# Altium schematic sheet 12VSupply_1.5A.SchDoc (part 1 of 2)
size A; SheetNumber: 3; SheetTotal: 3
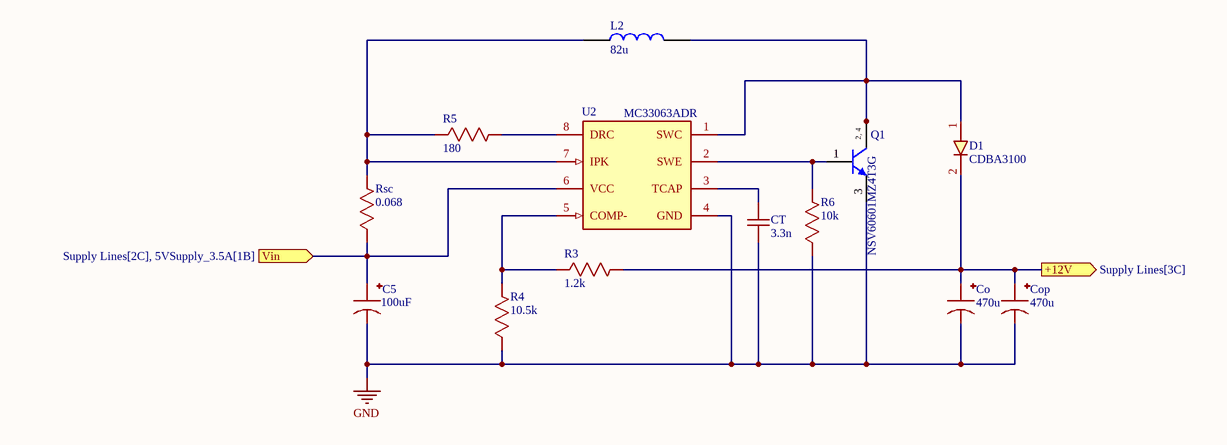
[diagram p0: 12VSupply_1.5A.SchDoc]

## Parts
C5  100uF  [CAPPRD350W60D800H1150]
Co  470u  [CAP_PKPZ_10X12P5_LOW_RUB]
Cop  470u  [CAP_PKPZ_10X12P5_LOW_RUB]
CT  3.3n  [(KEMET 0805) FP-C0805C-DN-IPC_A - duplicate]
D1  CDBA3100  [CDBA3100]
L2  82u  [PA4344823ANLT]
Q1  NSV60601MZ4T3G  [ONSC-SOT-223-4-318E-04_V]
R3  1.2k  [FP-CRGCQ0805-IPC_A]
R4  10.5k
R5  180  [FP-RMCF0805-IPC_A]
R6  10k  [FP-CRGCQ0805-IPC_A]
Rsc  0.068  [(1206) RESC3216X70X50NL05T20]
U2  MC33063ADR  [D0008A_L]

## Ports
+12V (out, see Supply Lines[3C]), Vin (in, see Supply Lines[2C], 5VSupply_3.5A[1B])

## Nets
GND: C5.2 Co.2 Cop.2 CT.1 Q1.3(E) R4.1 R6.1 U2.4(GND)
+12V: Co.1 Cop.1 D1.2 R3.2 ; port +12V
Vin: C5.1 Rsc.1 U2.6(VCC) ; port Vin
NetCT_2: CT.2 U2.3(TCAP)
NetD1_1: D1.1 L2.2 Q1.2(C) Q1.4(C) U2.1(SWC)
NetL2_1: L2.1 R5.1 Rsc.2 U2.7(IPK)
NetQ1_1: Q1.1(B) R6.2 U2.2(SWE)
NetR3_1: R3.1 R4.2 U2.5(COMP-)
NetR5_2: R5.2 U2.8(DRC)
## Library data of the parts
C5 = EEU-FR1V101B: FR ALUMINUM ELECTROLYTIC CAPACITOR Radial Can aluminum electrolytic capacitor 0.315Dia 8.00mm ±20% 100muF 35V; Manufacturer: Panasonic; Value: 100µF; Lead Diameter: 600µm; Life (Hours): 6000hours; Ripple Current: 950mA; Supplier: DigiKey; Supplier Part Number: P124226CT-ND; Manufacturer Part Number: EEU-FR1V101B; RoHS: Compliant; Category: Aluminum Electrolytic Capacitors; Stock: 15444; Pricing: 1=0.61, 10=0.383, 50=0.2852, 100=0.2542, 500=0.20076 (USD); Case/Package: Radial; Contact Plating: Tin; Diameter: 8mm; Lead Pitch: 5mm; Max Operating Temperature: 105°C; Min Operating Temperature: -40°C; Mounting Technology: Through Hole; Schedule B: 8532220020, 8532220020|8532220020, 8532220020|8532220020|8532220020, 8532220020|8532220020|8532220020|8532220020; Termination: Radial; Tolerance: 20%; ComponentLink1URL: https://datasheet.octopart.com:443/EEU-FR1V101B-Panasonic-datasheet-62330550.pdf?src-supplier=Electro+Sonic; ComponentLink1Description: https://datasheet.octopart.com:443/EEU-FR1V101B-Panasonic-datasheet-62330550.pdf?src-supplier=Electro+Sonic
Co Cop = 35PX470MEFC10X12.5: Aluminum Electrolytic Capacitor, Polarized, Aluminum (wet), 35V, 20% +Tol, 20% -Tol, 470uF; Manufacturer: Rubycon; Value: 470µF; Life (Hours): 2000hours; Polarity: Polar; Ripple Current: 525mA; Supplier: Mouser; Supplier Part Number: 232-35PX470MEFC10X12; Manufacturer Part Number: 35PX470MEFC10X12.5; RoHS: Compliant; Category: Aluminum Electrolytic Capacitors; Stock: 10207; Pricing: 1=0.46, 10=0.25, 50=0.25, 100=0.232, 1000=0.183, 10000=0.183 (USD); Case/Package: Radial; Diameter: 10mm; Height: 12.5mm; Height - Seated (Max): 13.9954mm; Lead Pitch: 5mm; Length: 12.5mm; Lifecycle Status: Production; Max Operating Temperature: 105°C; Min Operating Temperature: -55°C; Mounting Technology: Through Hole; Pins: 2; Number of Terminals: 2; Packaging: Bulk; REACH SVHC: Yes; Ripple Current (AC): 525mA; Schedule B: 8532220020, 8532220020|8532220020|8532220020|8532220020|8532220020; Terminal Pitch: 5mm; Tolerance: 20%; Voltage Rating: 35V; Voltage Rating (DC): 35V; ComponentLink1URL: https://datasheet.octopart.com:443/35PX470MEFC10X12.5-Rubycon-datasheet-159569471.pdf?src-supplier=IHS; ComponentLink1Description: https://datasheet.octopart.com:443/35PX470MEFC10X12.5-Rubycon-datasheet-159569471.pdf?src-supplier=IHS; ComponentLink2URL: https://datasheet.octopart.com:443/35PX470MEFC10X12.5-Rubycon-datasheet-86451557.pdf?src-supplier=Master+Electronics; ComponentLink2Description: https://datasheet.octopart.com:443/35PX470MEFC10X12.5-Rubycon-datasheet-86451557.pdf?src-supplier=Master+Electronics; ComponentLink3URL: https://datasheet.octopart.com:443/35PX470MEFC10X12.5-Rubycon-datasheet-41169268.pdf?src-supplier=Newark; ComponentLink3Description: https://datasheet.octopart.com:443/35PX470MEFC10X12.5-Rubycon-datasheet-41169268.pdf?src-supplier=Newark; ComponentLink4URL: https://datasheet.octopart.com:443/35PX470MEFC10X12.5-Rubycon-datasheet-12529491.pdf?src-supplier=element14+APAC; ComponentLink4Description: https://datasheet.octopart.com:443/35PX470MEFC10X12.5-Rubycon-datasheet-12529491.pdf?src-supplier=element14+APAC
CT = C0805C332K5RACTU: SMD Multilayer Ceramic Capacitor, 3300 pF, 50 V, 0805 [2012 Metric], X7R; Manufacturer: KEMET; Value: 3.3nF; Dissipation Factor: 2.5%; Temperature Coefficient: 30ppm/°C; Tolerance: 10%; Voltage: 50V; Supplier: Mouser; Supplier Part Number: 80-C0805C332K5R; Manufacturer Part Number: C0805C332K5RACTU; RoHS: Compliant; Category: Ceramic Capacitors; Stock: 23962; Pricing: 1=0.1, 10=0.03, 50=0.03, 100=0.026, 500=0.019, 1000=0.017, 4000=0.009, 8000=0.008, 10000=0.008 (USD); Case/Package: 0805; Case Code (Imperial): 0805; China RoHS: Compliant; Contact Plating: Tin; Country of Origin: Mexico; Depth: 1.25mm; Dielectric: X7R; Dielectric Material: Ceramic; Export Control Classification Number (ECCN) Code: EAR99; Height: 780µm; Harmonized Tariff Schedule (HTS) Code: 8532.24.00.20; Introduction Date: 2008-01-10; Lead Free: Lead Free; Lead Pitch: 750µm; Length: 2mm; Lifecycle Status: Production; Material: Ceramic; Max Operating Temperature: 125°C; Min Operating Temperature: -55°C; Mounting Technology: Surface Mount; Pins: 2; Number of Terminals: 2; Packaging: Cut Tape; Radiation Hardening: No; REACH SVHC: Yes; Schedule B: 8532240020, 8532240020|8532240020, 8532240020|8532240020|8532240020, 8532240020|8532240020|8532240020|8532240020; Termination: SMD/SMT; Thickness: 889µm; Voltage Rating: 50V; Voltage Rating (AC): 50V; Voltage Rating (DC): 50V; Width: 1.25mm; ComponentLink1URL: https://datasheet.octopart.com:443/C0805C332K5RACTU-KEMET-datasheet-178445679.pdf?src-supplier=IHS; ComponentLink1Description: https://datasheet.octopart.com:443/C0805C332K5RACTU-KEMET-datasheet-178445679.pdf?src-supplier=IHS; ComponentLink2URL: https://datasheet.octopart.com:443/C0805C332K5RAC7800-KEMET-datasheet-182042190.pdf?src-supplier=IHS; ComponentLink2Description: https://datasheet.octopart.com:443/C0805C332K5RAC7800-KEMET-datasheet-182042190.pdf?src-supplier=IHS; ComponentLink3URL: https://datasheet.octopart.com:443/C0805C332K5RACTU-KEMET-datasheet-137357759.pdf?src-supplier=Farnell; ComponentLink3Description: https://datasheet.octopart.com:443/C0805C332K5RACTU-KEMET-datasheet-137357759.pdf?src-supplier=Farnell; ComponentLink4URL: https://datasheet.octopart.com:443/C0805C332K5RACTU-Kemet-datasheet-12608295.pdf?src-supplier=Farnell; ComponentLink4Description: https://datasheet.octopart.com:443/C0805C332K5RACTU-Kemet-datasheet-12608295.pdf?src-supplier=Farnell; ComponentLink5URL: https://datasheet.octopart.com:443/C0805C332K5RACTU-Kemet-datasheet-11992184.pdf?src-supplier=Farnell; ComponentLink5Description: https://datasheet.octopart.com:443/C0805C332K5RACTU-Kemet-datasheet-11992184.pdf?src-supplier=Farnell; ComponentLink6URL: https://datasheet.octopart.com:443/C0805C332K5RACTU-Kemet-datasheet-10942409.pdf?src-supplier=Farnell; ComponentLink6Description: https://datasheet.octopart.com:443/C0805C332K5RACTU-Kemet-datasheet-10942409.pdf?src-supplier=Farnell; ComponentLink7URL: https://datasheet.octopart.com:443/C0805C332K5RACTU-Kemet-datasheet-10404442.pdf?src-supplier=Farnell; ComponentLink7Description: https://datasheet.octopart.com:443/C0805C332K5RACTU-Kemet-datasheet-10404442.pdf?src-supplier=Farnell; ComponentLink8URL: https://datasheet.octopart.com:443/C0805C332K5RACTU-KEMET-datasheet-101576272.pdf?src-supplier=Farnell; ComponentLink8Description: https://datasheet.octopart.com:443/C0805C332K5RACTU-KEMET-datasheet-101576272.pdf?src-supplier=Farnell; ComponentLink9URL: https://datasheet.octopart.com:443/C0805C332K5RACTU-KEMET-datasheet-176142338.pdf?src-supplier=Farnell; ComponentLink9Description: https://datasheet.octopart.com:443/C0805C332K5RACTU-KEMET-datasheet-176142338.pdf?src-supplier=Farnell; ComponentLink10URL: https://datasheet.octopart.com:443/C0805C332K5RACTU-Kemet-datasheet-500041.pdf?src-supplier=Farnell; ComponentLink10Description: https://datasheet.octopart.com:443/C0805C332K5RACTU-Kemet-datasheet-500041.pdf?src-supplier=Farnell; ComponentLink11URL: https://datasheet.octopart.com:443/C0805C332K5RACTU-Kemet-datasheet-10026209.pdf?src-supplier=Farnell; ComponentLink11Description: https://datasheet.octopart.com:443/C0805C332K5RACTU-Kemet-datasheet-10026209.pdf?src-supplier=Farnell; ComponentLink12URL: https://datasheet.octopart.com:443/C0805C332K5RACTU-KEMET-datasheet-68331921.pdf?src-supplier=Upverter; ComponentLink12Description: https://datasheet.octopart.com:443/C0805C332K5RACTU-KEMET-datasheet-68331921.pdf?src-supplier=Upverter; ComponentLink13URL: https://datasheet.octopart.com:443/C0805C332K5RACTU-KEMET-datasheet-159486434.pdf?src-supplier=Newark; ComponentLink13Description: https://datasheet.octopart.com:443/C0805C332K5RACTU-KEMET-datasheet-159486434.pdf?src-supplier=Newark; ComponentLink14URL: https://datasheet.octopart.com:443/C0805C332K5RACTU-Kemet-datasheet-5313890.pdf?src-supplier=Newark; ComponentLink14Description: https://datasheet.octopart.com:443/C0805C332K5RACTU-Kemet-datasheet-5313890.pdf?src-supplier=Newark; ComponentLink15URL: https://datasheet.octopart.com:443/C0805C332K5RACTU-KEMET-datasheet-176142341.pdf?src-supplier=Newark; ComponentLink15Description: https://datasheet.octopart.com:443/C0805C332K5RACTU-KEMET-datasheet-176142341.pdf?src-supplier=Newark; ComponentLink16URL: https://datasheet.octopart.com:443/C0805C332K5RACTU-KEMET-datasheet-130256537.pdf?src-supplier=Newark; ComponentLink16Description: https://datasheet.octopart.com:443/C0805C332K5RACTU-KEMET-datasheet-130256537.pdf?src-supplier=Newark; ComponentLink17URL: https://datasheet.octopart.com:443/C0805C332K5RACTU-Kemet-datasheet-8764837.pdf?src-supplier=Newark; ComponentLink17Description: https://datasheet.octopart.com:443/C0805C332K5RACTU-Kemet-datasheet-8764837.pdf?src-supplier=Newark; ComponentLink18URL: https://datasheet.octopart.com:443/C0805C332K5RACTU-Kemet-datasheet-8480123.pdf?src-supplier=Newark; ComponentLink18Description: https://datasheet.octopart.com:443/C0805C332K5RACTU-Kemet-datasheet-8480123.pdf?src-supplier=Newark; ComponentLink19URL: https://datasheet.octopart.com:443/C0805C332K5RACTU-Kemet-datasheet-5390537.pdf?src-supplier=Newark; ComponentLink19Description: https://datasheet.octopart.com:443/C0805C332K5RACTU-Kemet-datasheet-5390537.pdf?src-supplier=Newark; ComponentLink20URL: https://datasheet.octopart.com:443/C0805C332K5RACTU-Kemet-datasheet-5393970.pdf?src-supplier=Newark; ComponentLink20Description: https://datasheet.octopart.com:443/C0805C332K5RACTU-Kemet-datasheet-5393970.pdf?src-supplier=Newark; ComponentLink21URL: https://datasheet.octopart.com:443/C0805C332K5RACTU-Kemet-datasheet-8502025.pdf?src-supplier=Newark; ComponentLink21Description: https://datasheet.octopart.com:443/C0805C332K5RACTU-Kemet-datasheet-8502025.pdf?src-supplier=Newark; ComponentLink22URL: https://datasheet.octopart.com:443/C0805C332K5RACTU-Kemet-datasheet-7541751.pdf?src-supplier=Newark; ComponentLink22Description: https://datasheet.octopart.com:443/C0805C332K5RACTU-Kemet-datasheet-7541751.pdf?src-supplier=Newark; ComponentLink23URL: https://datasheet.octopart.com:443/C0805C332K5RACTU-Kemet-datasheet-161801.pdf?src-supplier=Newark; ComponentLink23Description: https://datasheet.octopart.com:443/C0805C332K5RACTU-Kemet-datasheet-161801.pdf?src-supplier=Newark; ComponentLink24URL: https://datasheet.octopart.com:443/C0805C332K5RACTU-KEMET-datasheet-37550250.pdf?src-supplier=Electro+Sonic; ComponentLink24Description: https://datasheet.octopart.com:443/C0805C332K5RACTU-KEMET-datasheet-37550250.pdf?src-supplier=Electro+Sonic; ComponentLink25URL: https://datasheet.octopart.com:443/C0805C332K5RACTU-KEMET-datasheet-164512540.pdf?src-supplier=TME; ComponentLink25Description: https://datasheet.octopart.com:443/C0805C332K5RACTU-KEMET-datasheet-164512540.pdf?src-supplier=TME; ComponentLink26URL: https://datasheet.octopart.com:443/C0805C332K5RACTU-Kemet-datasheet-68096424.pdf?src-supplier=TME; ComponentLink26Description: https://datasheet.octopart.com:443/C0805C332K5RACTU-Kemet-datasheet-68096424.pdf?src-supplier=TME; ComponentLink27URL: https://datasheet.octopart.com:443/C0805C332K5RACTU-KEMET-datasheet-68331906.pdf?src-supplier=TME; ComponentLink27Description: https://datasheet.octopart.com:443/C0805C332K5RACTU-KEMET-datasheet-68331906.pdf?src-supplier=TME; ComponentLink28URL: https://datasheet.octopart.com:443/C0805C332K5RACTU-KEMET-datasheet-110724412.pdf?src-supplier=RS+(Formerly+Allied+Electronics); ComponentLink28Description: https://datasheet.octopart.com:443/C0805C332K5RACTU-KEMET-datasheet-110724412.pdf?src-supplier=RS+(Formerly+Allied+Electronics); ComponentLink29URL: https://datasheet.octopart.com:443/C0805C332K5RACTU-Kemet-datasheet-464.pdf?src-supplier=RS+(Formerly+Allied+Electronics); ComponentLink29Description: https://datasheet.octopart.com:443/C0805C332K5RACTU-Kemet-datasheet-464.pdf?src-supplier=RS+(Formerly+Allied+Electronics); ComponentLink30URL: https://datasheet.octopart.com/C0805C332K5RACTU-KEMET-datasheet-84169754.pdf; ComponentLink30Description: https://datasheet.octopart.com/C0805C332K5RACTU-KEMET-datasheet-84169754.pdf; ComponentLink31URL: https://datasheet.octopart.com:443/C0805C332K5RACTU-Kemet-datasheet-22084244.pdf?src-supplier=element14+APAC; ComponentLink31Description: https://datasheet.octopart.com:443/C0805C332K5RACTU-Kemet-datasheet-22084244.pdf?src-supplier=element14+APAC; ComponentLink32URL: https://datasheet.octopart.com:443/C0805C332K5RAC7800-KEMET-datasheet-164857143.pdf?src-supplier=Burklin+Elektronik; ComponentLink32Description: https://datasheet.octopart.com:443/C0805C332K5RAC7800-KEMET-datasheet-164857143.pdf?src-supplier=Burklin+Elektronik; ComponentLink33URL: https://datasheet.octopart.com:443/C0805C332K5RAC-TU-Kemet-datasheet-8196850.pdf?src-supplier=Jameco; ComponentLink33Description: https://datasheet.octopart.com:443/C0805C332K5RAC-TU-Kemet-datasheet-8196850.pdf?src-supplier=Jameco
D1 = CDBA3100-G: Rectifier Diode, Schottky, 1 Phase, 1 Element, 3A, 100V V(RRM), Silicon, DO-214AC; Manufacturer: Comchip; Forward Voltage: 850mV; Max Forward Surge Current (Ifsm): 80A; Max Reverse Leakage Current: 500µA; Number of Elements: 1; Supplier: DigiKey; Supplier Part Number: 641-1099-1-ND; Manufacturer Part Number: CDBA3100-G; RoHS: Compliant; Category: Rectifier Diodes; Stock: 37850; Pricing: 1=0.32, 10=0.284, 100=0.2475, 500=0.24302, 2000=0.22072 (USD); Average Rectified Current: 3A; Contact Plating: Tin; Lifecycle Status: Obsolete; Max Operating Temperature: 150°C; Max Output current: 3A; Max Reverse Voltage (DC): 100V; Max Surge Current: 80A; Min Operating Temperature: -55°C; Mounting Technology: Surface Mount; Number of Terminals: 2; Peak Reverse Current: 500µA; REACH SVHC: No; Reverse Standoff Voltage: 100V; Schedule B: 8541100070, 8541100070|8541100070, 8541100070|8541100070|8541100070, 8541100070|8541100070|8541100070|8541100070; ComponentLink1URL: https://datasheet.octopart.com:443/CDBA3100-G-Comchip-datasheet-180126795.pdf?src-supplier=IHS; ComponentLink1Description: https://datasheet.octopart.com:443/CDBA3100-G-Comchip-datasheet-180126795.pdf?src-supplier=IHS; ComponentLink2URL: https://datasheet.octopart.com:443/CDBA3100-G-Comchip-datasheet-14434128.pdf?src-supplier=RS+(Formerly+Allied+Electronics); ComponentLink2Description: https://datasheet.octopart.com:443/CDBA3100-G-Comchip-datasheet-14434128.pdf?src-supplier=RS+(Formerly+Allied+Electronics)
L2 = PA4344.823ANLT: Inductor Power Shielded/Molded Wirewound 82uH 20% 100KHz 6.5A 0.083Ohm DCR T/R; Manufacturer: Pulse Electronics; DC Resistance (DCR): 83mΩ; Value: 82µH; Number of Circuits: 1; Supplier: Mouser; Supplier Part Number: 673-PA4344.823ANLT; Manufacturer Part Number: PA4344.823ANLT; RoHS: Compliant; Category: Fixed Inductors; Stock: 1073; Pricing: 1=3.66, 10=3.01, 50=2.94, 100=2.34, 1000=2.27, 10000=2.27 (USD); Country of Origin: Mainland China; Export Control Classification Number (ECCN) Code: EAR99; Height: 6.7mm; Harmonized Tariff Schedule (HTS) Code: 8504.50.80.00; Introduction Date: 2017-09-08; Lifecycle Status: Production; Max Current Rating: 6.5A; Max Operating Temperature: 155°C; Min Operating Temperature: -55°C; Number of Terminals: 2; REACH SVHC: Yes; Shielding: Shielded; Test Frequency: 100kHz; Tolerance: 20%; Width: 16.9mm; ComponentLink1URL: https://datasheet.octopart.com:443/PA4344.823ANLT-Pulse-datasheet-151605165.pdf?src-supplier=IHS; ComponentLink1Description: https://datasheet.octopart.com:443/PA4344.823ANLT-Pulse-datasheet-151605165.pdf?src-supplier=IHS; ComponentLink2URL: https://datasheet.octopart.com:443/PA4344.823ANLT-Pulse-datasheet-165545885.pdf?src-supplier=JRH+Electronics; ComponentLink2Description: https://datasheet.octopart.com:443/PA4344.823ANLT-Pulse-datasheet-165545885.pdf?src-supplier=JRH+Electronics; ComponentLink3URL: https://datasheet.octopart.com:443/PA4344.823ANLT-Pulse-Electronics-datasheet-184973453.pdf?src-supplier=Master+Electronics; ComponentLink3Description: https://datasheet.octopart.com:443/PA4344.823ANLT-Pulse-Electronics-datasheet-184973453.pdf?src-supplier=Master+Electronics; ComponentLink4URL: https://datasheet.octopart.com:443/PA4344.823ANLT-Pulse-datasheet-118084069.pdf?src-supplier=Sager+Electronics; ComponentLink4Description: https://datasheet.octopart.com:443/PA4344.823ANLT-Pulse-datasheet-118084069.pdf?src-supplier=Sager+Electronics; ComponentLink5URL: https://datasheet.octopart.com:443/PA4344.823ANLT-Pulse-datasheet-156002114.pdf?src-supplier=Future+Electronics; ComponentLink5Description: https://datasheet.octopart.com:443/PA4344.823ANLT-Pulse-datasheet-156002114.pdf?src-supplier=Future+Electronics
Q1 = NSV60601MZ4T3G: 60V 800mW 120@1A, 2V 6A NPN SOT-223 Bipolar Transistors - BJT ROHS; Manufacturer: onsemi; Manufacturer Lifecycle Status: ACTIVE; Collector Base Voltage (VCBO): 100V; hFE Min: 50; Max Power Dissipation: 2W; Number of Elements: 1; Transition Frequency: 100MHz; Supplier: Mouser; Supplier Part Number: 863-NSV60601MZ4T3G; Manufacturer Part Number: NSV60601MZ4T3G; RoHS: Compliant; Category: BJTs; Stock: 4495; Pricing: 1=0.99, 10=0.619, 50=0.619, 100=0.403, 1000=0.281, 10000=0.24 (USD); Case/Package: SOT-223-4; China RoHS: Non-Compliant; Collector Emitter Breakdown Voltage: 60V; Collector Emitter Voltage (VCEO): 60V; Country of Origin: Malaysia; Export Control Classification Number (ECCN) Code: EAR99; Halogen Free: Halogen Free; Introduction Date: 2007-09-19; Lead Free: Lead Free; Lifecycle Status: Production; Max Collector Current: 6A; Max Operating Temperature: 150°C; Min Operating Temperature: -55°C; Pins: 4; Number of Terminals: 4; Packaging: Tape and Reel; Polarity: NPN; Radiation Hardening: No; REACH SVHC: No; Schedule B: 8541290080, 8541290080|8541290080|8541290080|8541290080|8541290080; ComponentLink1URL: https://datasheet.octopart.com:443/NSV60601MZ4T3G-onsemi-datasheet-180967378.pdf?src-supplier=IHS; ComponentLink1Description: https://datasheet.octopart.com:443/NSV60601MZ4T3G-onsemi-datasheet-180967378.pdf?src-supplier=IHS; ComponentLink2URL: https://datasheet.octopart.com:443/NSV60601MZ4T3G-ON-Semiconductor-datasheet-12533590.pdf?src-supplier=Upverter; ComponentLink2Description: https://datasheet.octopart.com:443/NSV60601MZ4T3G-ON-Semiconductor-datasheet-12533590.pdf?src-supplier=Upverter; ComponentLink3URL: https://datasheet.octopart.com:443/NSV60601MZ4T3G-ON-Semiconductor-datasheet-606849.pdf?src-supplier=Upverter; ComponentLink3Description: https://datasheet.octopart.com:443/NSV60601MZ4T3G-ON-Semiconductor-datasheet-606849.pdf?src-supplier=Upverter; ComponentLink4URL: https://datasheet.octopart.com:443/NSV60601MZ4T3G-ON-Semiconductor-datasheet-21211183.pdf?src-supplier=Master+Electronics; ComponentLink4Description: https://datasheet.octopart.com:443/NSV60601MZ4T3G-ON-Semiconductor-datasheet-21211183.pdf?src-supplier=Master+Electronics; ComponentLink5URL: https://datasheet.octopart.com:443/NSV60601MZ4T3G-ON-Semiconductor-datasheet-11789331.pdf?src-supplier=Arrow+Electronics; ComponentLink5Description: https://datasheet.octopart.com:443/NSV60601MZ4T3G-ON-Semiconductor-datasheet-11789331.pdf?src-supplier=Arrow+Electronics; ComponentLink6URL: http://sigma.octopart.com:80/15540786/rohs_certificate/ON-Semiconductor-NSV60601MZ4T3G.pdf?src-supplier=Compliance+Statements; ComponentLink6Description: http://sigma.octopart.com:80/15540786/rohs_certificate/ON-Semiconductor-NSV60601MZ4T3G.pdf?src-supplier=Compliance+Statements; ComponentLink7URL: http://sigma.octopart.com:80/15684142/materials_sheet/ON-Semiconductor-NSV60601MZ4T3G.csv?src-supplier=Compliance+Statements; ComponentLink7Description: http://sigma.octopart.com:80/15684142/materials_sheet/ON-Semiconductor-NSV60601MZ4T3G.csv?src-supplier=Compliance+Statements; ComponentLink8URL: http://sigma.octopart.com:80/150628244/rohs_statement/ON-Semiconductor-NSV60601MZ4T3G.pdf?src-supplier=Compliance+Statements; ComponentLink8Description: http://sigma.octopart.com:80/150628244/rohs_statement/ON-Semiconductor-NSV60601MZ4T3G.pdf?src-supplier=Compliance+Statements; ComponentLink9URL: http://sigma.octopart.com:80/reach_statement/ON-Semiconductor-company-79.pdf?src-supplier=Compliance+Statements; ComponentLink9Description: http://sigma.octopart.com:80/reach_statement/ON-Semiconductor-company-79.pdf?src-supplier=Compliance+Statements; ComponentLink10URL: https://octopart.com:443/opatz8j6/c1?t=Fq9RzD1z76oITuJnUUIIje9FnkMVw7ujGmtvxlL00zEvNMuOTriP7ey4Z3fRDYHD9Ctmb2fFYDrQaTM328HbVSlQMdsz6cadFcpeZ3i-y4W-8NNzytqH1aDcYoJZxSLKkuhNMq89DChMVVbIPDo3_9CKO0jwaYgtXJ2tr_4Ac0NiaTg-0nbrA8WXrwmEPPzNMpnToj5WBXCY927xqXj6u9aDy6C97GxIEVr9rPPowPeLQdmU012F5EopcAhi18yvGvo97zShD_va5H4ofGkJIYYZwQ54_et4WUoF8BvkpBQpihA89mEv272vegbmvhlz6zCyIE0Zs8UG_eGBnLWEM_DH1msLZlWc-DnRoDw36JidmA&src-supplier=Compliance+Statements; ComponentLink10Description: https://octopart.com:443/opatz8j6/c1?t=Fq9RzD1z76oITuJnUUIIje9FnkMVw7ujGmtvxlL00zEvNMuOTriP7ey4Z3fRDYHD9Ctmb2fFYDrQaTM328HbVSlQMdsz6cadFcpeZ3i-y4W-8NNzytqH1aDcYoJZxSLKkuhNMq89DChMVVbIPDo3_9CKO0jwaYgtXJ2tr_4Ac0NiaTg-0nbrA8WXrwmEPPzNMpnToj5WBXCY927xqXj6u9aDy6C97GxIEVr9rPPowPeLQdmU012F5EopcAhi18yvGvo97zShD_va5H4ofGkJIYYZwQ54_et4WUoF8BvkpBQpihA89mEv272vegbmvhlz6zCyIE0Zs8UG_eGBnLWEM_DH1msLZlWc-DnRoDw36JidmA&src-supplier=Compliance+Statements; ComponentLink11URL: https://octopart.com:443/opatz8j6/c1?t=tsQCiBBqWjRv9H8_qbVEh58QX2dyIyjSx_cb_gShZ_LdjRhCJs2v19vJ3hL_KsOOYdLsEBJYel_52N-cvg8Nzchwl-Vd808wzW76ClgUy7p7O7OrMqJgWE9jlp_z7LQvFoUP7UyMrYrQG4La1ByiYJ6EqOVy0piM5QlrfCjZhxQkqVLmIZ55MdyQ9G7T5qS0aXRldBDlea3nPYCTSrbUz_3IkUli_7v4SpOJX9E9w3x3bcf4MS5otDIfWZsdEsyNPX7iWCy7wP_q6j1AoCZFXN9d-Ms9tvnyBheX3UlYZTBXdEAQ2qSpJyKZlEuTOQRh73pTUHv4FAck1aaFrOxKMKoUbyEzp1lIlMLsYkCyxUN0&src-supplier=Compliance+Statements; ComponentLink11Description: https://octopart.com:443/opatz8j6/c1?t=tsQCiBBqWjRv9H8_qbVEh58QX2dyIyjSx_cb_gShZ_LdjRhCJs2v19vJ3hL_KsOOYdLsEBJYel_52N-cvg8Nzchwl-Vd808wzW76ClgUy7p7O7OrMqJgWE9jlp_z7LQvFoUP7UyMrYrQG4La1ByiYJ6EqOVy0piM5QlrfCjZhxQkqVLmIZ55MdyQ9G7T5qS0aXRldBDlea3nPYCTSrbUz_3IkUli_7v4SpOJX9E9w3x3bcf4MS5otDIfWZsdEsyNPX7iWCy7wP_q6j1AoCZFXN9d-Ms9tvnyBheX3UlYZTBXdEAQ2qSpJyKZlEuTOQRh73pTUHv4FAck1aaFrOxKMKoUbyEzp1lIlMLsYkCyxUN0&src-supplier=Compliance+Statements
R3 = CRG0805F1K2: Fixed Resistor, Thick Film, 0.125W, 1200ohm, 150V, 1% +/-Tol, 100ppm/Cel, Surface Mount, 0805; Manufacturer: TE Connectivity; Manufacturer Lifecycle Status: ACTIVE; Max Power Dissipation: 125mW; Number of Resistors: 1; Value: 1.2kΩ; Temperature Coefficient: 100ppm/°C; Supplier: Mouser; Supplier Part Number: 279-CRG0805F1K2; Manufacturer Part Number: CRG0805F1K2; RoHS: Compliant; Category: Chip SMD Resistors; Stock: 124570; Pricing: 1=0.1, 10=0.022, 50=0.022, 100=0.018, 1000=0.011, 10000=0.006 (USD); Case/Package: 0805; Case Code (Imperial): 0805; Case Code (Metric): 2012; China RoHS: Non-Compliant; Composition: Thick Film; Depth: 1.25mm; Export Control Classification Number (ECCN) Code: EAR99; ELV: Compliant; Height: 550µm; Harmonized Tariff Schedule (HTS) Code: 8533.21.00.30; Introduction Date: 2003-09-18; Length: 2mm; Lifecycle Status: Production; Max Operating Temperature: 125°C; Military Standard: Not; Min Operating Temperature: -55°C; Mounting Technology: Surface Mount; Number of Terminals: 2; Number of Terminations: 2; Operating Supply Voltage: 150V; Packaging: Tape & Reel (TR); Power Dissipation: 125mW; Power Rating: 125mW; Radiation Hardening: No; REACH SVHC: Yes; Termination: Solder; Tolerance: 1%; Voltage Rating: 150V; Width: 1.25mm; Working Voltage: 150V; ComponentLink1URL: https://datasheet.octopart.com:443/CRG0805F1K2-TE-Connectivity-datasheet-167977698.pdf?src-supplier=IHS; ComponentLink1Description: https://datasheet.octopart.com:443/CRG0805F1K2-TE-Connectivity-datasheet-167977698.pdf?src-supplier=IHS; ComponentLink2URL: https://datasheet.octopart.com:443/CRG0805F1K2-TE-Connectivity-datasheet-182172479.pdf?src-supplier=IHS; ComponentLink2Description: https://datasheet.octopart.com:443/CRG0805F1K2-TE-Connectivity-datasheet-182172479.pdf?src-supplier=IHS; ComponentLink3URL: https://datasheet.octopart.com:443/CRG0805F1K2-TE-Connectivity-datasheet-11120284.pdf?src-supplier=Farnell; ComponentLink3Description: https://datasheet.octopart.com:443/CRG0805F1K2-TE-Connectivity-datasheet-11120284.pdf?src-supplier=Farnell; ComponentLink4URL: https://datasheet.octopart.com:443/CRG0805F1K2-TE-Connectivity-datasheet-44624597.pdf?src-supplier=Farnell; ComponentLink4Description: https://datasheet.octopart.com:443/CRG0805F1K2-TE-Connectivity-datasheet-44624597.pdf?src-supplier=Farnell; ComponentLink5URL: https://datasheet.octopart.com:443/CRG0805F1K2-TE-Connectivity-datasheet-128558484.pdf?src-supplier=Master+Electronics; ComponentLink5Description: https://datasheet.octopart.com:443/CRG0805F1K2-TE-Connectivity-datasheet-128558484.pdf?src-supplier=Master+Electronics; ComponentLink6URL: https://datasheet.octopart.com:443/1623133-1-TE-Connectivity---AMP-datasheet-189108518.pdf?src-supplier=Master+Electronics; ComponentLink6Description: https://datasheet.octopart.com:443/1623133-1-TE-Connectivity---AMP-datasheet-189108518.pdf?src-supplier=Master+Electronics; ComponentLink7URL: https://datasheet.octopart.com:443/CRG0805F1K2-Tyco-Electronics-datasheet-11120141.pdf?src-supplier=Electro+Sonic; ComponentLink7Description: https://datasheet.octopart.com:443/CRG0805F1K2-Tyco-Electronics-datasheet-11120141.pdf?src-supplier=Electro+Sonic; ComponentLink8URL: https://sigma.octopart.com:443/14530244/technical_drawing/TE-Connectivity-CRG0805F1K2.pdf?src-supplier=Sager+Electronics; ComponentLink8Description: https://sigma.octopart.com:443/14530244/technical_drawing/TE-Connectivity-CRG0805F1K2.pdf?src-supplier=Sager+Electronics; ComponentLink9URL: https://datasheet.octopart.com:443/CRG0805F1K2-TE-Connectivity-datasheet-137111056.pdf?src-supplier=X-ON; ComponentLink9Description: https://datasheet.octopart.com:443/CRG0805F1K2-TE-Connectivity-datasheet-137111056.pdf?src-supplier=X-ON; ComponentLink10URL: https://datasheet.octopart.com:443/CRG0805F1K2-TE-Connectivity-datasheet-111046813.pdf?src-supplier=RS+(Formerly+Allied+Electronics); ComponentLink10Description: https://datasheet.octopart.com:443/CRG0805F1K2-TE-Connectivity-datasheet-111046813.pdf?src-supplier=RS+(Formerly+Allied+Electronics); ComponentLink11URL: https://datasheet.octopart.com:443/CRG0805F1K2-TE-Connectivity-datasheet-20739855.pdf?src-supplier=RS+(Formerly+Allied+Electronics); ComponentLink11Description: https://datasheet.octopart.com:443/CRG0805F1K2-TE-Connectivity-datasheet-20739855.pdf?src-supplier=RS+(Formerly+Allied+Electronics); ComponentLink12URL: https://datasheet.octopart.com:443/CRG0805F1K2-Tyco-Electronics-datasheet-9755276.pdf?src-supplier=RS+(Formerly+Allied+Electronics); ComponentLink12Description: https://datasheet.octopart.com:443/CRG0805F1K2-Tyco-Electronics-datasheet-9755276.pdf?src-supplier=RS+(Formerly+Allied+Electronics); ComponentLink13URL: http://sigma.octopart.com:80/14530243/rohs_certificate/TE-Connectivity-CRG0805F1K2.pdf?src-supplier=Compliance+Statements; ComponentLink13Description: http://sigma.octopart.com:80/14530243/rohs_certificate/TE-Connectivity-CRG0805F1K2.pdf?src-supplier=Compliance+Statements; ComponentLink14URL: http://sigma.octopart.com:80/62063384/materials_sheet/TE-Connectivity-CRG0805F1K2.pdf?src-supplier=Compliance+Statements; ComponentLink14Description: http://sigma.octopart.com:80/62063384/materials_sheet/TE-Connectivity-CRG0805F1K2.pdf?src-supplier=Compliance+Statements
R4 = RMCF0805FT10K5: Res Thick Film 0805 10.5K Ohm 1% 0.125W ±100ppm/°C Molded SMD Paper T/R; Manufacturer: Stackpole Electronics; Max Power Dissipation: 125mW; Value: 10.5kΩ; Voltage Rating: 150V; Supplier: Mouser; Supplier Part Number: 708-RMCF0805FT10K5; Manufacturer Part Number: RMCF0805FT10K5; RoHS: Compliant; Category: Chip SMD Resistors; Stock: 17097; Pricing: 1=0.1, 10=0.008, 50=0.008, 100=0.007, 1000=0.007, 10000=0.002 (USD); Case/Package: 0805; Case Code (Imperial): 0805; Case Code (Metric): 2012; China RoHS: Non-Compliant; Composition: Thick Film; Contact Plating: Tin; Country of Origin: Japan, Mainland China, Taiwan; Export Control Classification Number (ECCN) Code: EAR99; Features: Automotive AEC-Q200; Height: 500µm; Harmonized Tariff Schedule (HTS) Code: 8533.21.00.30; Introduction Date: 2011-01-07; Lead Free: Lead Free; Length: 2.0066mm; Lifecycle Status: Production; Max Operating Temperature: 155°C; Min Operating Temperature: -55°C; Mounting Technology: Surface Mount; Number of Terminals: 2; Number of Terminations: 2; Packaging: Cut Tape (CT); Power Dissipation: 125mW; Power Rating: 125mW; Radiation Hardening: No; REACH SVHC: Yes; Schedule B: 8533210045, 8533210045|8533210045|8533210045|8533210045|8533210045; Temperature Coefficient: 100ppm/°C; Tolerance: 1%; Width: 1.25mm; Working Voltage: 150V; ComponentLink1URL: https://datasheet.octopart.com:443/RMCF0805FT10K5-Stackpole-Electronics-datasheet-182148065.pdf?src-supplier=IHS; ComponentLink1Description: https://datasheet.octopart.com:443/RMCF0805FT10K5-Stackpole-Electronics-datasheet-182148065.pdf?src-supplier=IHS; ComponentLink2URL: https://datasheet.octopart.com:443/RMCF0805FT10K5-Stackpole-Electronics-datasheet-28504820.pdf?src-supplier=Upverter; ComponentLink2Description: https://datasheet.octopart.com:443/RMCF0805FT10K5-Stackpole-Electronics-datasheet-28504820.pdf?src-supplier=Upverter; ComponentLink3URL: https://datasheet.octopart.com:443/RMCF0805FT10K5-Stackpole-Electronics-datasheet-141193804.pdf?src-supplier=Future+Electronics; ComponentLink3Description: https://datasheet.octopart.com:443/RMCF0805FT10K5-Stackpole-Electronics-datasheet-141193804.pdf?src-supplier=Future+Electronics; ComponentLink4URL: https://datasheet.octopart.com:443/RMCF0805FT10K5-Stackpole-Electronics-datasheet-116606903.pdf?src-supplier=Future+Electronics; ComponentLink4Description: https://datasheet.octopart.com:443/RMCF0805FT10K5-Stackpole-Electronics-datasheet-116606903.pdf?src-supplier=Future+Electronics; ComponentLink5URL: https://datasheet.octopart.com:443/RMCF0805FT10K5-Stackpole-Electronics-datasheet-62091608.pdf?src-supplier=Stackpole+Electronics; ComponentLink5Description: https://datasheet.octopart.com:443/RMCF0805FT10K5-Stackpole-Electronics-datasheet-62091608.pdf?src-supplier=Stackpole+Electronics; ComponentLink6URL: https://datasheet.octopart.com:443/RMCF0805FT10K5-Stackpole-Electronics-datasheet-12534581.pdf?src-supplier=Stackpole+Electronics; ComponentLink6Description: https://datasheet.octopart.com:443/RMCF0805FT10K5-Stackpole-Electronics-datasheet-12534581.pdf?src-supplier=Stackpole+Electronics; ComponentLink7URL: https://datasheet.octopart.com:443/RMCF0805FT10K5-Stackpole-Electronics-datasheet-10788263.pdf?src-supplier=Stackpole+Electronics; ComponentLink7Description: https://datasheet.octopart.com:443/RMCF0805FT10K5-Stackpole-Electronics-datasheet-10788263.pdf?src-supplier=Stackpole+Electronics; ComponentLink8URL: http://sigma.octopart.com:80/15940719/materials_sheet/Stackpole-Electronics-RMCF0805FT10K5.pdf?src-supplier=Compliance+Statements; ComponentLink8Description: http://sigma.octopart.com:80/15940719/materials_sheet/Stackpole-Electronics-RMCF0805FT10K5.pdf?src-supplier=Compliance+Statements; ComponentLink9URL: http://sigma.octopart.com:80/141158212/rohs_statement/Stackpole-Electronics-RMCF0805FT10K5.pdf?src-supplier=Compliance+Statements; ComponentLink9Description: http://sigma.octopart.com:80/141158212/rohs_statement/Stackpole-Electronics-RMCF0805FT10K5.pdf?src-supplier=Compliance+Statements; ComponentLink10URL: http://sigma.octopart.com:80/141158211/reach_statement/Stackpole-Electronics-RMCF0805FT10K5.pdf?src-supplier=Compliance+Statements; ComponentLink10Description: http://sigma.octopart.com:80/141158211/reach_statement/Stackpole-Electronics-RMCF0805FT10K5.pdf?src-supplier=Compliance+Statements
R5 = RMCF0805JT180R: Res Thick Film 0805 180 Ohm 5% 0.125W(1/8W) ±200ppm/C Pad SMD Automotive T/R; Manufacturer: Stackpole Electronics; Max Power Dissipation: 125mW; Value: 180Ω; Temperature Coefficient: 100ppm/°C; Voltage Rating: 150V; Supplier: Mouser; Supplier Part Number: 708-RMCF0805JT180R; Manufacturer Part Number: RMCF0805JT180R; RoHS: Compliant; Category: Chip SMD Resistors; Stock: 102621; Pricing: 1=0.1, 10=0.007, 50=0.007, 100=0.006, 1000=0.006, 10000=0.002 (USD); Case/Package: 0805; Case Code (Imperial): 0805; Case Code (Metric): 2012; China RoHS: Non-Compliant; Composition: Thick Film; Contact Plating: Tin; Country of Origin: Japan, Mainland China, Taiwan; Depth: 1.25mm; Export Control Classification Number (ECCN) Code: EAR99; Features: Automotive AEC-Q200; Height: 500µm; Harmonized Tariff Schedule (HTS) Code: 8533.21.00.30; Introduction Date: 2011-01-07; Lead Free: Lead Free; Length: 2.0066mm; Lifecycle Status: Production; Max Operating Temperature: 155°C; Military Standard: Not; Min Operating Temperature: -55°C; Mounting Technology: Surface Mount; Number of Terminals: 2; Number of Terminations: 2; Packaging: Digi-Reel®; Power Dissipation: 125mW; Power Rating: 125mW; Radiation Hardening: No; REACH SVHC: Yes; Schedule B: 8533210045, 8533210045|8533210045, 8533210045|8533210045|8533210045, 8533210045|8533210045|8533210045|8533210045; Tolerance: 5%; Width: 1.25mm; Working Voltage: 150V; ComponentLink1URL: https://datasheet.octopart.com:443/RMCF0805JT180R-Stackpole-Electronics-datasheet-182148065.pdf?src-supplier=IHS; ComponentLink1Description: https://datasheet.octopart.com:443/RMCF0805JT180R-Stackpole-Electronics-datasheet-182148065.pdf?src-supplier=IHS; ComponentLink2URL: https://datasheet.octopart.com:443/RMCF0805JT180R-Stackpole-Electronics-datasheet-28504820.pdf?src-supplier=Upverter; ComponentLink2Description: https://datasheet.octopart.com:443/RMCF0805JT180R-Stackpole-Electronics-datasheet-28504820.pdf?src-supplier=Upverter; ComponentLink3URL: https://datasheet.octopart.com:443/RMCF0805JT180R-Stackpole-Electronics-datasheet-141193804.pdf?src-supplier=Master+Electronics; ComponentLink3Description: https://datasheet.octopart.com:443/RMCF0805JT180R-Stackpole-Electronics-datasheet-141193804.pdf?src-supplier=Master+Electronics; ComponentLink4URL: https://datasheet.octopart.com:443/RMCF0805JT180R-Stackpole-Electronics-datasheet-189104163.pdf?src-supplier=Master+Electronics; ComponentLink4Description: https://datasheet.octopart.com:443/RMCF0805JT180R-Stackpole-Electronics-datasheet-189104163.pdf?src-supplier=Master+Electronics; ComponentLink5URL: https://datasheet.octopart.com:443/RMCF0805JT180R-Stackpole-Electronics-datasheet-116606903.pdf?src-supplier=Master+Electronics; ComponentLink5Description: https://datasheet.octopart.com:443/RMCF0805JT180R-Stackpole-Electronics-datasheet-116606903.pdf?src-supplier=Master+Electronics; ComponentLink6URL: https://datasheet.octopart.com:443/RMCF0805JT180R-Stackpole-Electronics-datasheet-12534581.pdf?src-supplier=Future+Electronics; ComponentLink6Description: https://datasheet.octopart.com:443/RMCF0805JT180R-Stackpole-Electronics-datasheet-12534581.pdf?src-supplier=Future+Electronics; ComponentLink7URL: https://datasheet.octopart.com:443/RMCF0805JT180R-Stackpole-Electronics-datasheet-12510902.pdf?src-supplier=Future+Electronics; ComponentLink7Description: https://datasheet.octopart.com:443/RMCF0805JT180R-Stackpole-Electronics-datasheet-12510902.pdf?src-supplier=Future+Electronics; ComponentLink8URL: https://datasheet.octopart.com:443/RMCF0805JT180R-Stackpole-Electronics-datasheet-62091608.pdf?src-supplier=Stackpole+Electronics; ComponentLink8Description: https://datasheet.octopart.com:443/RMCF0805JT180R-Stackpole-Electronics-datasheet-62091608.pdf?src-supplier=Stackpole+Electronics; ComponentLink9URL: https://datasheet.octopart.com:443/RMCF0805JT180R-Stackpole-Electronics-datasheet-10788263.pdf?src-supplier=Stackpole+Electronics; ComponentLink9Description: https://datasheet.octopart.com:443/RMCF0805JT180R-Stackpole-Electronics-datasheet-10788263.pdf?src-supplier=Stackpole+Electronics; ComponentLink10URL: http://sigma.octopart.com:80/15940719/materials_sheet/Stackpole-Electronics-RMCF0805JT180R.pdf?src-supplier=Compliance+Statements; ComponentLink10Description: http://sigma.octopart.com:80/15940719/materials_sheet/Stackpole-Electronics-RMCF0805JT180R.pdf?src-supplier=Compliance+Statements; ComponentLink11URL: http://sigma.octopart.com:80/141158212/rohs_statement/Stackpole-Electronics-RMCF0805JT180R.pdf?src-supplier=Compliance+Statements; ComponentLink11Description: http://sigma.octopart.com:80/141158212/rohs_statement/Stackpole-Electronics-RMCF0805JT180R.pdf?src-supplier=Compliance+Statements; ComponentLink12URL: http://sigma.octopart.com:80/141158211/reach_statement/Stackpole-Electronics-RMCF0805JT180R.pdf?src-supplier=Compliance+Statements; ComponentLink12Description: http://sigma.octopart.com:80/141158211/reach_statement/Stackpole-Electronics-RMCF0805JT180R.pdf?src-supplier=Compliance+Statements
R6 = CRGCQ0805J10K: Res Thick Film 0805 10K Ohm 5% 0.125W(1/8W) ±100ppm/C Pad SMD Automotive T/R; Manufacturer: TE Connectivity; Manufacturer Lifecycle Status: ACTIVE; Operating Supply Voltage: 150V; Power Dissipation: 125mW; Value: 10kΩ; Temperature Coefficient: 100ppm/°C; Supplier: DigiKey; Supplier Part Number: A130140CT-ND; Manufacturer Part Number: CRGCQ0805J10K; RoHS: Compliant; Category: Chip SMD Resistors; Stock: 448725; Pricing: 1=0.1, 10=0.031, 25=0.0232, 50=0.0188, 100=0.0153, 250=0.01204, 500=0.01016, 1000=0.00868 (USD); Ambient Temperature Range High: 70°C; China RoHS: Non-Compliant; Composition: Thick Film; Height: 550µm; Lifecycle Status: Production; Max Operating Temperature: 155°C; Min Operating Temperature: -55°C; Mounting Technology: Surface Mount; Number of Terminals: 2; Packaging: Cut Tape; Power Rating: 125mW; REACH SVHC: Yes; Schedule B: 8533210025, 8533210025|8533210025|8533210025|8533210025|8533210025, 8533210045; Tolerance: 5%; Voltage Rating: 150V; Voltage Rating (DC): 150V; Width: 1.25mm; Working Voltage: 150V; ComponentLink1URL: https://datasheet.octopart.com:443/CRGCQ0805J10K-TE-Connectivity-datasheet-114679081.pdf?src-supplier=Master+Electronics; ComponentLink1Description: https://datasheet.octopart.com:443/CRGCQ0805J10K-TE-Connectivity-datasheet-114679081.pdf?src-supplier=Master+Electronics; ComponentLink2URL: https://datasheet.octopart.com:443/2-2176342-5-TE-Connectivity---AMP-datasheet-189108688.pdf?src-supplier=Master+Electronics; ComponentLink2Description: https://datasheet.octopart.com:443/2-2176342-5-TE-Connectivity---AMP-datasheet-189108688.pdf?src-supplier=Master+Electronics; ComponentLink3URL: https://datasheet.octopart.com:443/CRGCQ0805J10K-TE-Connectivity-datasheet-179161841.pdf?src-supplier=IHS; ComponentLink3Description: https://datasheet.octopart.com:443/CRGCQ0805J10K-TE-Connectivity-datasheet-179161841.pdf?src-supplier=IHS; ComponentLink4URL: https://sigma.octopart.com:443/114702769/technical_drawing/TE-Connectivity-CRGCQ0805J10K.pdf?src-supplier=Sager+Electronics; ComponentLink4Description: https://sigma.octopart.com:443/114702769/technical_drawing/TE-Connectivity-CRGCQ0805J10K.pdf?src-supplier=Sager+Electronics
Rsc = ERJ-8BWFR068V: Res Thick Film 1206 0.068 Ohm 1% 1W ±100ppm/°C Molded SMD SMD Punched Carrier T/R; Manufacturer: Panasonic; Manufacturer Lifecycle Status: ACTIVE; Part Series: Current Sensing Resistors Thick Film Type; Value: 68mΩ; Working Voltage: 260.8mV; Supplier: DigiKey; Supplier Part Number: P.068AUCT-ND; Manufacturer Part Number: ERJ-8BWFR068V; RoHS: Compliant; Category: Chip SMD Resistors; Stock: 31382; Pricing: 1=0.66, 10=0.393, 25=0.3332, 50=0.299, 100=0.2718, 250=0.24428, 500=0.22836, 1000=0.21569 (USD); Case/Package: 1206; Case Code (Imperial): 1206; Case Code (Metric): 3216; Composition: Thick Film; Contact Plating: Tin; Depth: 1.6mm; Features: Automotive AEC-Q200; Height: 650µm; Lead Free: Lead Free; Length: 3.2mm; Lifecycle Status: Production; Max Operating Temperature: 155°C; Max Power Dissipation: 1W; Military Standard: Not; Min Operating Temperature: -55°C; Mounting Technology: Surface Mount; Pins: 2; Number of Terminals: 2; Number of Terminations: 2; Packaging: Cut Tape; Power Dissipation: 1W; Power Rating: 1W; Radiation Hardening: No; REACH SVHC: Yes; Schedule B: 8533210045, 8533210045|8533210045, 8533210045|8533210045|8533210045, 8533210045|8533210045|8533210045|8533210045; Temperature Coefficient: 100ppm/°C; Termination: SMD/SMT; Tolerance: 1%; Width: 1.6mm; ComponentLink1URL: https://datasheet.octopart.com:443/ERJ-8BWFR068V-Panasonic-datasheet-68299093.pdf?src-supplier=Panasonic; ComponentLink1Description: https://datasheet.octopart.com:443/ERJ-8BWFR068V-Panasonic-datasheet-68299093.pdf?src-supplier=Panasonic; ComponentLink2URL: https://datasheet.octopart.com:443/ERJ-8BWFR068V-Panasonic-datasheet-119112.pdf?src-supplier=Newark; ComponentLink2Description: https://datasheet.octopart.com:443/ERJ-8BWFR068V-Panasonic-datasheet-119112.pdf?src-supplier=Newark; ComponentLink3URL: https://datasheet.octopart.com:443/ERJ-8BWFR068V-Panasonic-datasheet-159764274.pdf?src-supplier=Newark; ComponentLink3Description: https://datasheet.octopart.com:443/ERJ-8BWFR068V-Panasonic-datasheet-159764274.pdf?src-supplier=Newark; ComponentLink4URL: https://datasheet.octopart.com:443/ERJ-8BWFR068V-Panasonic-datasheet-41172793.pdf?src-supplier=Farnell; ComponentLink4Description: https://datasheet.octopart.com:443/ERJ-8BWFR068V-Panasonic-datasheet-41172793.pdf?src-supplier=Farnell; ComponentLink5URL: https://datasheet.octopart.com:443/ERJ8BWFR068V-Panasonic---ECG-datasheet-15994758.pdf?src-supplier=Farnell; ComponentLink5Description: https://datasheet.octopart.com:443/ERJ8BWFR068V-Panasonic---ECG-datasheet-15994758.pdf?src-supplier=Farnell; ComponentLink6URL: https://datasheet.octopart.com:443/ERJ-8BWFR068V-Panasonic-datasheet-154766170.pdf?src-supplier=Master+Electronics; ComponentLink6Description: https://datasheet.octopart.com:443/ERJ-8BWFR068V-Panasonic-datasheet-154766170.pdf?src-supplier=Master+Electronics; ComponentLink7URL: https://datasheet.octopart.com:443/ERJ8BWFR068V-Panasonic-datasheet-12469511.pdf?src-supplier=element14+APAC; ComponentLink7Description: https://datasheet.octopart.com:443/ERJ8BWFR068V-Panasonic-datasheet-12469511.pdf?src-supplier=element14+APAC; ComponentLink8URL: https://datasheet.octopart.com:443/ERJ-8BWFR068V-Panasonic-datasheet-13271236.pdf?src-supplier=RS+(Formerly+Allied+Electronics); ComponentLink8Description: https://datasheet.octopart.com:443/ERJ-8BWFR068V-Panasonic-datasheet-13271236.pdf?src-supplier=RS+(Formerly+Allied+Electronics); ComponentLink9URL: https://datasheet.octopart.com:443/ERJ8BWFR068V-Panasonic-datasheet-10176864.pdf?src-supplier=RS+(Formerly+Allied+Electronics); ComponentLink9Description: https://datasheet.octopart.com:443/ERJ8BWFR068V-Panasonic-datasheet-10176864.pdf?src-supplier=RS+(Formerly+Allied+Electronics); ComponentLink10URL: https://datasheet.octopart.com:443/ERJ8BWFR068V-Panasonic-datasheet-170667598.pdf?src-supplier=TME; ComponentLink10Description: https://datasheet.octopart.com:443/ERJ8BWFR068V-Panasonic-datasheet-170667598.pdf?src-supplier=TME; ComponentLink11URL: https://datasheet.octopart.com:443/ERJ8BWFR068V-Panasonic-datasheet-164871471.pdf?src-supplier=Burklin+Elektronik; ComponentLink11Description: https://datasheet.octopart.com:443/ERJ8BWFR068V-Panasonic-datasheet-164871471.pdf?src-supplier=Burklin+Elektronik; ComponentLink12URL: https://datasheet.octopart.com:443/ERJ-8BWFR068V-Panasonic-datasheet-62346600.pdf?src-supplier=Future+Electronics; ComponentLink12Description: https://datasheet.octopart.com:443/ERJ-8BWFR068V-Panasonic-datasheet-62346600.pdf?src-supplier=Future+Electronics; ComponentLink13URL: https://datasheet.octopart.com:443/ERJ-8BWFR068V-Panasonic-datasheet-62099257.pdf?src-supplier=Electro+Sonic; ComponentLink13Description: https://datasheet.octopart.com:443/ERJ-8BWFR068V-Panasonic-datasheet-62099257.pdf?src-supplier=Electro+Sonic; ComponentLink14URL: https://datasheet.octopart.com:443/ERJ-8BWFR068V-Panasonic-datasheet-22087634.pdf?src-supplier=Electro+Sonic; ComponentLink14Description: https://datasheet.octopart.com:443/ERJ-8BWFR068V-Panasonic-datasheet-22087634.pdf?src-supplier=Electro+Sonic